# Altium schematic sheet AC-PWR-v2.0.SchDoc
size A4
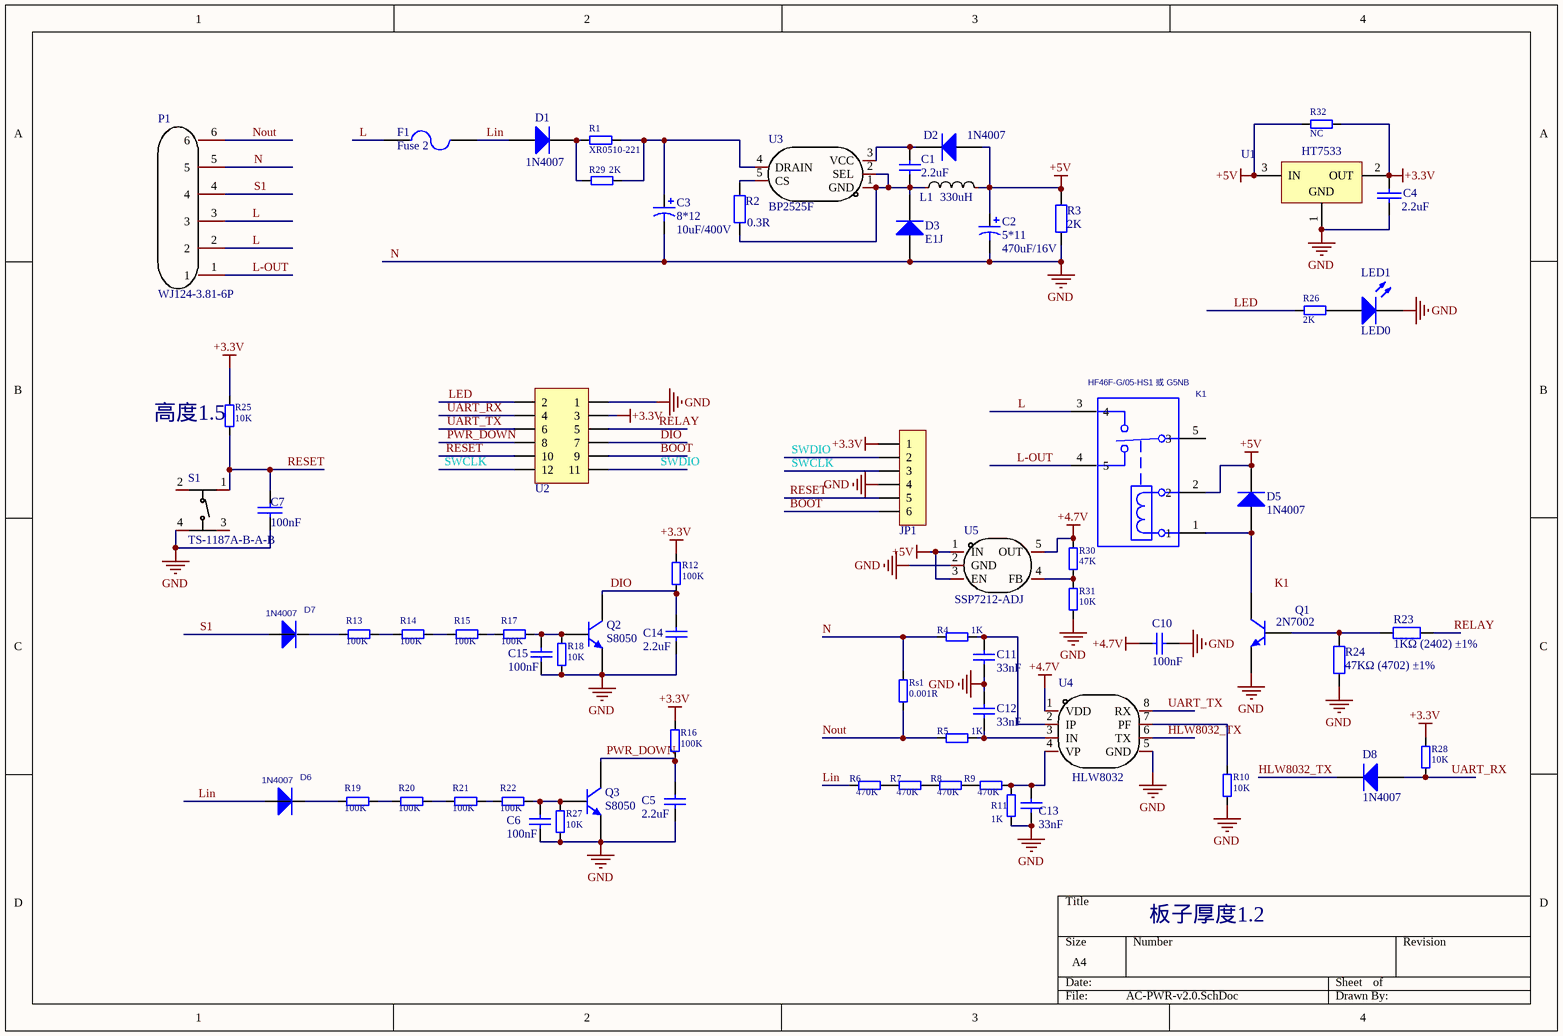
[diagram p0: AC-PWR-v2.0.SchDoc]

## Parts
C1  value 2.2uF  [0805_C]  (hidden comment: 1uF)
C2  5*11  value 470uF/16V  [CE/2 *5-11]
C3  8*12  value 10uF/400V  [Cap8*12]
C4  2.2uF  [0603_C]
C5  value 2.2uF  [0603_C]  (hidden comment: Cap)
C6  value 100nF  [0603_C]  (hidden comment: Cap)
C7  100nF  [0603_C]
C10  value 100nF  [0603_C]  (hidden comment: Cap)
C11  value 33nF  [0603_C]  (hidden comment: Cap)
C12  value 33nF  [0603_C]  (hidden comment: Cap)
C13  value 33nF  [0805_C]  (hidden comment: Cap)
C14  value 2.2uF  [0603_C]  (hidden comment: Cap)
C15  value 100nF  [0603_C]  (hidden comment: Cap)
D1  1N4007  [SOD-123]
D2  1N4007  [SOD-123]
D3  E1J  [SOD-123]
D5  1N4007  [SOD-123]
D6  Model Number: 1N4007  [SOD-123F]  (hidden comment: D_M7)
D7  Model Number: 1N4007  [SOD-123F]  (hidden comment: D_M7)
D8  1N4007  [SOD-123]
F1  Fuse 2  [PCBComponent_1 - duplicate1]
JP1  HDR-1X6  [HDR2.0-LI-6P]  (value not drawn)
K1  HF46F-G/05-HS1 或 G5NB  [HF46F-F]
L1  330uH  [L3.5-8X11.5]
LED1  LED0  [0603_LED_S1]
P1  WJ124-3.81-6P  [CONN-TH_6P-P5.00_WJ500V-5.08-3P]
Q1  2N7002  [SOT-23(SOT-23-3)]
Q2  S8050  [SOT-23-3L]
Q3  S8050  [SOT-23-3L]
R1  XR0510-221  [PCBComponent_1 - duplicate]
R2  0.3R  [1206_R]
R3  2K  [0603_R]
R4  1K  [0603_R]
R5  1K  [0603_R]
R6  470K  [0805_R]
R7  470K  [0805_R]
R8  470K  [0805_R]
R9  470K  [0805_R]
R10  10K  [0603_R]
R11  1K  [0805_R]
R12  100K  [0603_R]
R13  100K  [0805_R]
R14  100K  [0805_R]
R15  100K  [0805_R]
R16  100K  [0603_R]
R17  100K  [0805_R]
R18  10K  [0603_R]
R19  100K  [0805_R]
R20  100K  [0805_R]
R21  100K  [0805_R]
R22  100K  [0805_R]
R23  1KΩ (2402) ±1%  [0603_R]
R24  47KΩ (4702) ±1%  [0603_R]
R25  10K  [0603_R]
R26  2K  [0603_R]
R27  10K  [0603_R]
R28  10K  [0603_R]
R29  2K  [2010_R]
R30  47K  [0603_R]
R31  10K  [0603_R]
R32  NC  [0603_R]
Rs1  0.001R  [2512_R]
S1  TS-1187A-B-A-B  [SW-SMD_4P-L5.1-W5.1-P3.70-LS6.5-TL-2]
U1  HT7533  [SOT-23(SOT-23-3)]
U2  Header 6X2  [module]  (value not drawn)
U3  BP2525F  [SOT33-5A_L3.9-W2.6-P0.90-BP2525D]
U4  HLW8032  [SOP-8_150mil]
U5  Name: SSP7212-ADJ  [SOT-23-5]  (hidden comment: ZTP7001-00)

## Nets
+3.3V: C4.1 JP1.1 R12.2 R16.2 R25.2 R28.1 R32.1 U1.2(OUT) U2.3
+4.7V: C10.1 R30.1 U4.1(VDD) U5.5(OUT)
+5V: C2.1 D2.1(A) D5.2(K) K1.2 L1.2 R3.1 R32.2 U1.3(IN) U5.1(IN) U5.3(EN)
N: C2.2 C3.2 C4.2 C5.1 C6.1 C7.1 C10.2 C11.1 C12.2 C13.1 C14.1 C15.1 D3.1(A) JP1.4 LED1.K P1.5 Q1.2(E) Q2.2(E) Q3.2(E) R3.2 R4.2 R10.2 R11.1 R18.1 R24.1 R27.1 R31.2 Rs1.1 S1.4(D) U1.1(GND) U2.1 U4.5(GND) U5.2(GND)  [also labelled GND]
BOOT: JP1.6 U2.9
DIO: C14.2 Q2.3(C) R12.1 U2.7
HLW8032_TX: D8.2(K) U4.6(TX)
L: F1.1 K1.3(4) P1.2 P1.3
L-OUT: K1.4(5) P1.1
LED: R26.2 U2.2
Lin: D1.1(A) D6.1 F1.2 R6.1
Nout: P1.6 R5.2 Rs1.2
PWR_DOWN: C5.2 Q3.3(C) R16.1 U2.8
RELAY: R23.1 U2.5
RESET: C7.2 JP1.5 R25.1 S1.1(A) U2.10
S1: D7.1 P1.4
SWCLK: JP1.3 U2.12
SWDIO: JP1.2 U2.11
UART_RX: D8.1(A) R28.2 U2.4
UART_TX: U2.6 U4.8(RX)
NetC1_1: C1.1 D3.2(K) L1.1 R2.1 U3.1(GND) U3.2(SEL)
NetC1_2: C1.2 D2.2(K) U3.3(VCC)
NetC3_1: C3.1 R1.2 R29.1 U3.4(DRAIN)
NetC6_2: C6.2 Q3.1(B) R22.2 R27.2
NetC11_2: C11.2 R4.1 U4.2(IP)
NetC12_1: C12.1 R5.1 U4.3(IN)
NetC13_2: C13.2 R9.2 R11.2 U4.4(VP)
NetC15_2: C15.2 Q2.1(B) R17.2 R18.2
NetD1_2: D1.2(K) R1.1 R29.2
NetD5_1: D5.1(A) K1.1 Q1.3(C)
NetD6_2: D6.2 R19.1
NetD7_2: D7.2 R13.1
NetLED1_A: LED1.A R26.1
NetQ1_1: Q1.1(B) R23.2 R24.2
NetR2_2: R2.2 U3.5(CS)
NetR6_2: R6.2 R7.1
NetR7_2: R7.2 R8.1
NetR8_2: R8.2 R9.1
NetR10_1: R10.1 U4.7(PF)
NetR13_2: R13.2 R14.1
NetR14_2: R14.2 R15.1
NetR15_2: R15.2 R17.1
NetR19_2: R19.2 R20.1
NetR20_2: R20.2 R21.1
NetR21_2: R21.2 R22.1
NetR30_2: R30.2 R31.1 U5.4(FB)

Not connected (* = marked no-connect by the designer): K1 5(3); S1 2(B) 3(C)

## Notes on the sheet
- (near R25) 高度1.5
- 板子厚度1.2
- Labels drawn without touching a wire or pin: K1

## Library data of the parts
C1 C5 C6 C10-C15 = Cap: Capacitor; Published: 8-Jun-2000; LatestRevisionDate: 17-Jul-2002; LatestRevisionNote: Re-released for DXP Platform.; PackageReference: RAD-0.3; Publisher: Altium Limited
  C1: PackageDescription: Radial Cap, Thru-Hole; 2 Leads; 0.3 in Pin Spacing
C2 C3 = Cap Pol3: Polarized Capacitor (Surface Mount); Published: 8-Jun-2000; LatestRevisionDate: 29-May-2009; LatestRevisionNote: IPC-7351 Footprint Added.; PackageReference: C0805; Publisher: Altium Limited; PackageDescription: Chip Capacitor
C4 C7 = CAP: Capacitor
D1-D3 D5 D8 = LL-34 LL4148 LL-34 1206: 开关二极管; ComponentLink1Description: 供应商链接; ComponentLink1URL: http://www.szlcsc.com/product/details_10338.html; Package: LL-34; Supplier: LC; SuppliersPartNumber: C9808
D6 D7 = D: Ferrite And Shape: DO-41; PCB DECAL: D_M7
F1 = Fuse 2: Fuse; Published: 8-Jun-2000; LatestRevisionDate: 17-Jul-2002; LatestRevisionNote: Re-released for DXP Platform.; PackageReference: PIN-W2/E2.8; Publisher: Altium Limited; PackageDescription: Thru-Hole; 2 Leads
JP1 = Header 6: 6P接插件; 封装库来自淘宝卖家 ID：黄晶宝石: https://shop463601444.taobao.com
K1 = RLY-MZ-SPDT: 1A SPDT RELAY 16 X 12 DUAL INLINE PITCH; Sim.Analog.Order: Model$; PCB DECAL: RLY-MZ
L1 = FNR5040S3R0NT: SLP0810R-331KTT; Manufacturer: cjiang(长江微电); Add into BOM: yes; Value: 3uH; Tolerance: ±30%; Rated Current: 4A; Saturation Current (Isat): 4.6A; DC Resistance (DCR): 22mΩ; Name: 330uH; Symbol: FNR5040S3R0NT; Device: FNR5040S3R0NT; LCSC Part Name: 3uH ±30% 4.6A; Supplier Part: C167959; Manufacturer Part: FNR5040S3R0NT; Supplier Footprint: SMD,5x5mm; JLCPCB Part Class: 扩展库; Datasheet: https://atta.szlcsc.com/upload/public/pdf/source/20190327/C167925_9EFF0AABC4CA629C2CC95961DBF7D39D.pdf; Supplier: LCSC; Convert to PCB: yes
LED1 = LED0: Typical INFRARED GaAs LED; Published: 8-Jun-2000; LatestRevisionDate: 08-Jul-2005; LatestRevisionNote: Mech Layer 1 removed.; PackageReference: LED-0; Publisher: Altium Limited
P1 = WJ124-3.81-6P: 间距:3.81mm;结构:1x6P;排数:1;每排PIN数:6;安装方式:直针;额定电流:15A;额定电压:300V;线规 - AWG:14~30;线规 - mm2:1.5;工作温度范围:-40℃~+105℃;颜色:绿色;; Manufacturer: KANGNEX(康奈克斯电气); Add into BOM: yes; Pitch: 3.81mm; Structure: 1x6P; Number of PINs Per Row: 6; Current Rating (Max): 15A; Voltage Rating (Max): 300V; Wire Gauge - AWG: 14~30; Wire Gauge - mm2: 1.5; Name: WJ124-3.81-6P; Symbol: WJ124-3.81-6P; Device: WJ124-3.81-6P; LCSC Part Name: 3.81mm 1x6P 排数:1 每排P数:6 直针; Supplier Part: C69810; Manufacturer Part: WJ124-3.81-6P; Supplier Footprint: 插件,P=3.81mm; JLCPCB Part Class: 扩展库; Datasheet: https://atta.szlcsc.com/upload/public/pdf/source/20191225/C69810_9DA15DFDF19F1708D2A08860AC3A3380.pdf; Supplier: LCSC; Convert to PCB: yes; Number of Rows: 1; Mounting Style: 直针; Operating Temperature Range: -40℃~+105℃; Color: 绿色
Q1 = SOT-23 MMBT5551  G1: 三极管; ComponentLink1Description: 供应商链接; ComponentLink1URL: http://www.szlcsc.com/product/details_2502.html; Package: SOT-23; Supplier: LC; SuppliersPartNumber: C2145
Q2 Q3 = 2N3904: NPN General Purpose Amplifier; Published: 8-Jun-2000; LatestRevisionDate: 15-Jan-2003; LatestRevisionNote: PCB Footprint 'BCY-W3/D4.7' replaced; DatasheetDocument: 1997; PackageDocument: Sep-1998; PackageReference: TO-92A; Publisher: Altium Limited; Code_JEDEC: TO-92A; ComponentLink1Description: Manufacturer Link; ComponentLink1URL: http://www.fairchildsemi.com/; ComponentLink2Description: Datasheet; ComponentLink2URL: http://www.fairchildsemi.com/ds/2N%2F2N3904.pdf
R1 = RES2: KNP2WS-33R
R2 R3 R23 = 0603 24KΩ (2402) 1%: 贴片电阻; ComponentLink1Description: 供应商链接; ComponentLink1URL: http://www.szlcsc.com/product/details_24085.html; Package: 0603; Supplier: LC; SuppliersPartNumber: C23352
R4-R22 R25-R32 Rs1 = RES2: resistor
R24 = 0603 47KΩ (4702) 1%: 贴片电阻; ComponentLink1Description: 供应商链接; ComponentLink1URL: http://www.szlcsc.com/product/details_26562.html; Package: 0603; Supplier: LC; SuppliersPartNumber: C25819
S1 = TS-1187A-B-A-B: 触点电流:50mA;额定电压(DC):12V;绝缘电阻:-;电路结构:单刀单掷;安装方式:立贴;带灯:无;作用力:160gf;机械寿命:10万次;带支架:否;; Manufacturer: XKB Connectivity(中国星坤); Add into BOM: yes; Contact Current: 50mA; Voltage Rating (DC): 12V; Circuit: 单刀单掷; Actuator Style: 圆形按钮; Actuator/Cap Color: 金色; With Lamp: 无; Operating Force: 160gf; Mechanical Life: 10万次; Switch Length: 5.1mm; Switch Height: 1.5mm; Strike Gundam: 否; Name: TS-1187A-B-A-B; Symbol: TS-1187A-B-A-B; Device: TS-1187A-B-A-B; LCSC Part Name: 5.1*5.1*1.5mm 立贴 轻触开关 防水金属头; Supplier Part: C318884; Manufacturer Part: TS-1187A-B-A-B; Supplier Footprint: SMD; JLCPCB Part Class: 基础库; Datasheet: https://atta.szlcsc.com/upload/public/pdf/source/20200227/C318884_1F20165719E1C4CAA3E10C4C359C6E26.pdf; Supplier: LCSC; Convert to PCB: yes; Insulation Resistance: -; Mounting Style: 立贴; Operating Temperature: -30℃~+85℃; Switch Width: 5.1mm
U1 = LM1086IT-3.3: 1.5A Low Dropout Positive Regulators; Manufacturer: National Semiconductor; CompType: LDO IC; PackageTopMarking: NSUZXYTTE#*LM1086*IT-3.3; Published: 4-Dec-2008; DatasheetVersion: Jun-2005; PackageVersion: revL, Jan-1992; PackageReference: T03B; Publisher: Altium Limited; PackageDescription: TO-220, Molded, 3 Lead, Straight; PartNumber: LM1086IT-3.3; RoHS: O; PinCount: 3; DigiKeyPartNumber: LM1086IT-3.3-ND; ComponentLink1Description: LM1086 Datasheet; ComponentLink1URL: http://www.national.com/ds/LM/LM1086.pdf; ComponentLink2Description: LM1086 Web Page; ComponentLink2URL: http://www.national.com/pf/LM/LM1086.html; ComponentLink3Description: T03B Package Page; ComponentLink3URL: http://www.national.com/packaging/folders/t03b.html
U2 = Header  6X2: 6*2P接插件; 封装库来自淘宝卖家 ID：黄晶宝石: 唯一出售店铺网址
U3 = BP2525F: 功能类型:降压型;输出电压:5V；3.3V;输出电流(最大值):500mA;; Manufacturer: BPS(上海晶丰明源); Add into BOM: yes; Function: 降压型; Output Current (Max): 500mA; Name: BP2525F; Symbol: BP2525F; Device: BP2525F; LCSC Part Name: AC-DC电源芯片; Supplier Part: C5119887; Manufacturer Part: BP2525F; Supplier Footprint: SOT-33-5A; JLCPCB Part Class: 扩展库; Datasheet: https://atta.szlcsc.com/upload/public/pdf/source/20220829/5C189150963CB58B39240986058B8A7F.pdf; Supplier: LCSC; Convert to PCB: yes; Output Voltage: 5V；3.3V
U4 = HLW8032: HLW8012的升级版串口输出所有数据; Manufacturer: 合力为; Add into BOM: yes; Name: HLW8032; Symbol: HLW8032; Device: HLW8032; LCSC Part Name: HLW8032; Supplier Part: C128023; Manufacturer Part: HLW8032; Supplier Footprint: SOP-8-150mil; JLCPCB Part Class: 扩展库; Datasheet: https://atta.szlcsc.com/upload/public/pdf/source/20170914/C128023_1505359448866967741.pdf; Supplier: LCSC; Convert to PCB: yes
U5 = ZTP7001-00: 输出类型:可调;最大输入电压:6V;最大输出电流:600mA;电源纹波抑制比(PSRR):70dB@(1kHz);输出极性:正极;; Manufacturer: ZILLTEK(钰太); Add into BOM: yes; Output Type: 可调; Maximum Input Voltage: 6V; MAX Output Current: 600mA; Dropout Voltage: 420mV@600mA; standby current: 65uA; Noise: 70uVrms; Output Polarity: 正极; Number of Outputs: 1; Symbol: ZTP7001-00; Device: ZTP7001-00; LCSC Part Name: ADJ 输入6V 600mA; Supplier Part: C481271; Manufacturer Part: ZTP7001-00; Supplier Footprint: SOT-23-5L; JLCPCB Part Class: 扩展库; Datasheet: https://atta.szlcsc.com/upload/public/pdf/source/20200316/C481271_37005D32BF4F8ED193C0BA4B50B2338C.pdf; Supplier: LCSC; Convert to PCB: yes; Power Supply Rejection Ratio (PSRR): 70dB@(1kHz); Feature: 过流保护；使能；软启动；过热保护; Operating Temperature: -40℃~+125℃@(Tj)